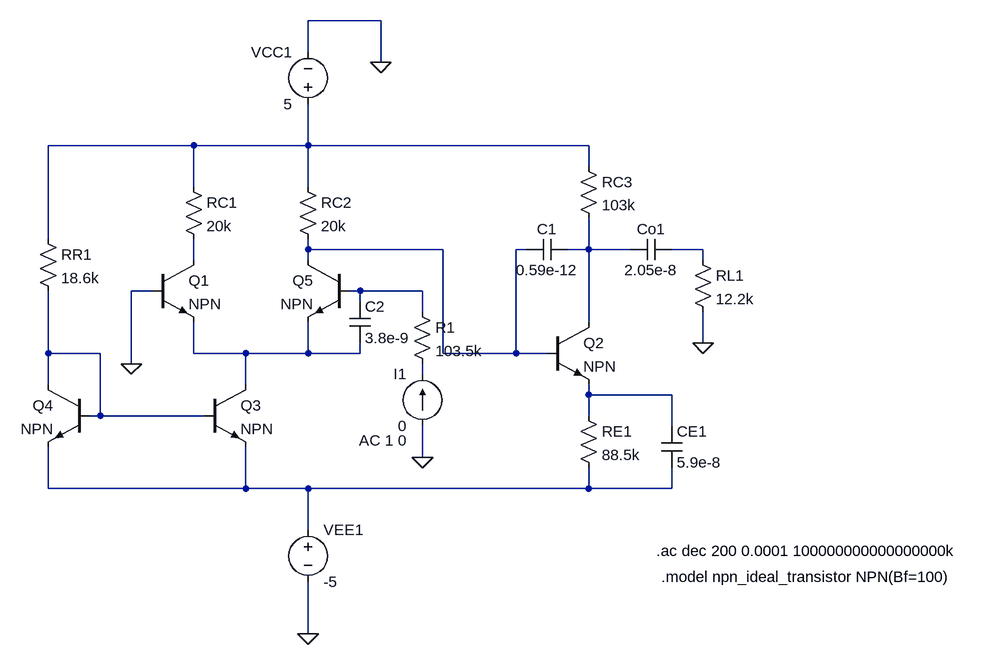
[diagram p0: schematic Rin.asc]
Rin.asc, the LTspice schematic file:
Version 4
SHEET 1 1324 704
WIRE 256 -288 144 -288
WIRE 144 -240 144 -288
WIRE 256 -224 256 -288
WIRE -32 -96 -256 -96
WIRE 144 -96 144 -160
WIRE 144 -96 -32 -96
WIRE 576 -96 144 -96
WIRE 576 -64 576 -96
WIRE -32 -32 -32 -96
WIRE 144 -32 144 -96
WIRE -256 48 -256 -96
WIRE 144 64 144 48
WIRE 352 64 144 64
WIRE 480 64 464 64
WIRE 576 64 576 16
WIRE 576 64 544 64
WIRE 640 64 576 64
WIRE 752 64 704 64
WIRE -32 80 -32 48
WIRE 144 80 144 64
WIRE 752 80 752 64
WIRE -96 128 -128 128
WIRE 224 128 208 128
WIRE 320 128 224 128
WIRE 224 144 224 128
WIRE 320 160 320 128
WIRE 576 176 576 64
WIRE 752 208 752 160
WIRE -256 224 -256 128
WIRE -176 224 -256 224
WIRE -32 224 -32 176
WIRE 48 224 -32 224
WIRE 144 224 144 176
WIRE 144 224 48 224
WIRE 224 224 224 208
WIRE 224 224 144 224
WIRE 352 224 352 64
WIRE 464 224 464 64
WIRE 464 224 352 224
WIRE 512 224 464 224
WIRE -128 240 -128 128
WIRE 320 256 320 240
WIRE -256 272 -256 224
WIRE 48 272 48 224
WIRE 576 288 576 272
WIRE 704 288 576 288
WIRE -176 320 -176 224
WIRE -176 320 -192 320
WIRE -16 320 -176 320
WIRE 576 320 576 288
WIRE 704 336 704 288
WIRE 320 384 320 336
WIRE -256 432 -256 368
WIRE 48 432 48 368
WIRE 48 432 -256 432
WIRE 144 432 48 432
WIRE 576 432 576 400
WIRE 576 432 144 432
WIRE 704 432 704 400
WIRE 704 432 576 432
WIRE 144 496 144 432
WIRE 144 656 144 576
FLAG 752 208 0
FLAG 144 656 0
FLAG 256 -224 0
FLAG -128 240 0
FLAG 320 384 0
SYMBOL res -48 -48 R0
SYMATTR InstName RC1
SYMATTR Value 20k
SYMBOL res 128 -48 R0
SYMATTR InstName RC2
SYMATTR Value 20k
SYMBOL Res 560 304 R0
SYMATTR InstName RE1
SYMATTR Value 88.5k
SYMBOL Res -272 32 R0
SYMATTR InstName RR1
SYMATTR Value 18.6k
SYMBOL Res 560 -80 R0
SYMATTR InstName RC3
SYMATTR Value 103k
SYMBOL npn -96 80 R0
SYMATTR InstName Q1
SYMBOL npn 512 176 R0
SYMATTR InstName Q2
SYMBOL npn -16 272 R0
SYMATTR InstName Q3
SYMBOL npn -192 272 M0
SYMATTR InstName Q4
SYMBOL npn 208 80 M0
SYMATTR InstName Q5
SYMBOL voltage 144 480 R0
SYMATTR InstName VEE1
SYMATTR Value -5
SYMBOL voltage 144 -144 R180
WINDOW 0 24 96 Left 2
WINDOW 3 24 16 Left 2
SYMATTR InstName VCC1
SYMATTR Value 5
SYMBOL Res 736 64 R0
SYMATTR InstName RL1
SYMATTR Value 12.2k
SYMBOL cap 704 48 R90
WINDOW 0 0 32 VBottom 2
WINDOW 3 32 32 VTop 2
SYMATTR InstName Co1
SYMATTR Value 2.05e-8
SYMBOL cap 688 336 R0
SYMATTR InstName CE1
SYMATTR Value 5.9e-8
SYMBOL cap 544 48 R90
WINDOW 0 0 32 VBottom 2
WINDOW 3 32 32 VTop 2
SYMATTR InstName C1
SYMATTR Value 0.59e-12
SYMBOL cap 208 144 R0
SYMATTR InstName C2
SYMATTR Value 3.8e-9
SYMBOL Res 304 144 R0
SYMATTR InstName R1
SYMATTR Value 103.5k
SYMBOL current 320 336 R180
WINDOW 0 24 80 Left 2
WINDOW 3 24 0 Left 2
WINDOW 123 24 -22 Left 2
SYMATTR InstName I1
SYMATTR Value 0
SYMATTR Value2 AC 1 0
TEXT 680 528 Left 2 !.ac dec 200 0.0001 100000000000000000k
TEXT 688 568 Left 2 !.model npn_ideal_transistor NPN(Bf=100)

The netlist it stands for:
* Rin.asc
RC1 N001 N005 20k
RC2 N001 N002 20k
RE1 N010 N011 88.5k
RR1 N001 N007 18.6k
RC3 N001 N003 103k
Q1 N005 0 N008 0 NPN
Q2 N003 N002 N010 0 NPN
Q3 N008 N007 N011 0 NPN
Q4 N007 N007 N011 0 NPN
Q5 N002 N006 N008 0 NPN
VEE1 N011 0 -5
VCC1 N001 0 5
RL1 N004 0 12.2k
Co1 N004 N003 2.05e-8
CE1 N010 N011 5.9e-8
C1 N003 N002 0.59e-12
C2 N006 N008 3.8e-9
R1 N006 N009 103.5k
I1 0 N009 0 AC 1 0
.model NPN NPN
.model PNP PNP
.lib standard.bjt
.ac dec 200 0.0001 100000000000000000k
.model npn_ideal_transistor NPN(Bf=100)
.backanno
.end